# Altium project TEMD_ESA.PrjPcb
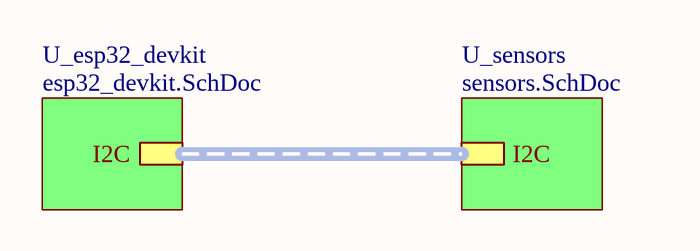
[diagram p0: main.SchDoc]
3 sheets, 13 parts. Net scope: hierarchical (ports join the sheet entries above them; power ports are global).
Board file: TEMD_ESA_PCB.PcbDoc
Sheets:
  main.SchDoc
    U_esp32_devkit = esp32_devkit.SchDoc
    U_sensors = sensors.SchDoc

## Sheet main.SchDoc
size A4; SheetNumber: 1; SheetTotal: 4

### Sub-sheets
U_esp32_devkit = esp32_devkit.SchDoc: I2C (harness I2C)
U_sensors = sensors.SchDoc: I2C (harness I2C)

### Buses and harness runs
harness sheet U_esp32_devkit/I2C = sheet U_sensors/I2C

## Sheet esp32_devkit.SchDoc
size A4; SheetNumber: 3; SheetTotal: 3
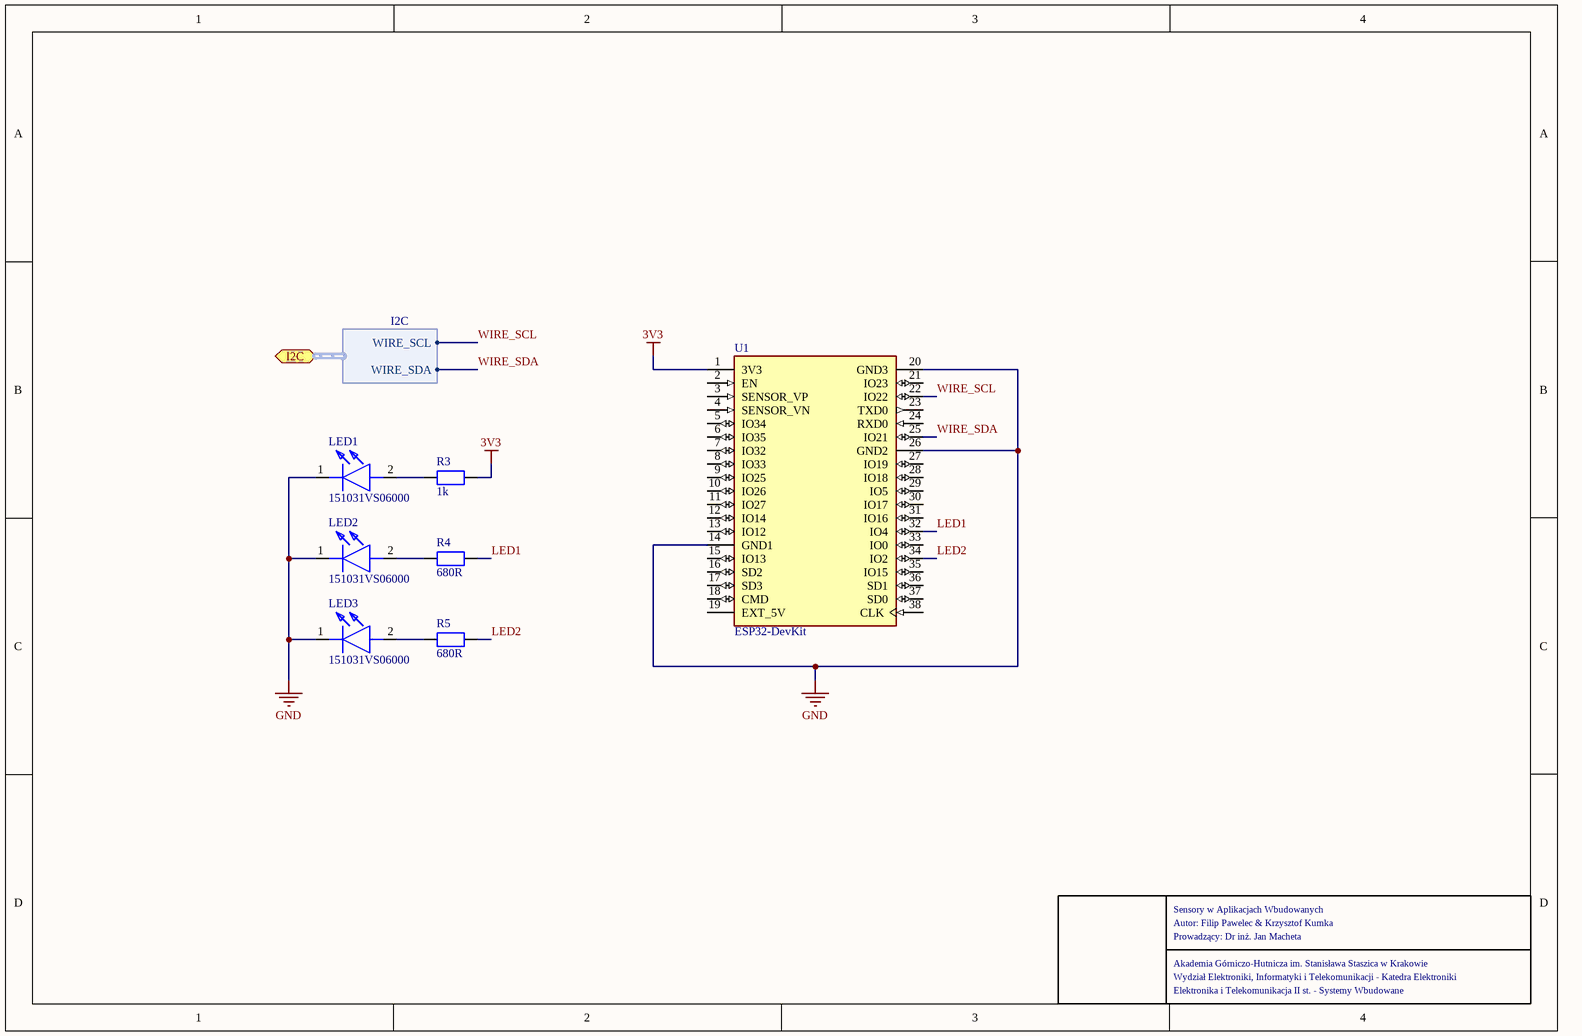
[diagram p1: esp32_devkit.SchDoc]

### Parts
LED1  151031VS06000  [151034GS03000]
LED2  151031VS06000  [151034GS03000]
LED3  151031VS06000  [151034GS03000]
R3  1k  [R0603]
R4  680R  [R0603]
R5  680R  [R0603]
U1  ESP32-DevKit  [MODULE_ESP32-DEVKIT]

### Ports
I2C (bidir, harness I2C)

### Harnesses
I2C: WIRE_SCL, WIRE_SDA

### Nets
3V3: R3.2 U1.1(3V3)
GND: LED1.1(K) LED2.1(K) LED3.1(K) U1.14(GND1) U1.20(GND3) U1.26(GND2)
LED1: R4.2 U1.32(IO4)
LED2: R5.2 U1.34(IO2)
WIRE_SCL: U1.22(IO22) ; port I2C.WIRE_SCL
WIRE_SDA: U1.25(IO21) ; port I2C.WIRE_SDA
NetLED1_2: LED1.2(A) R3.1
NetLED2_2: LED2.2(A) R4.1
NetLED3_2: LED3.2(A) R5.1

Not connected (* = marked no-connect by the designer): U1 2(EN) 3(SENSOR_VP) 4(SENSOR_VN) 5(IO34) 6(IO35) 7(IO32) 8(IO33) 9(IO25) 10(IO26) 11(IO27) 12(IO14) 13(IO12) 15(IO13) 16(SD2) 17(SD3) 18(CMD) 19(EXT_5V) 21(IO23) 23(TXD0) 24(RXD0) 27(IO19) 28(IO18) 29(IO5) 30(IO17) 31(IO16) 33(IO0) 35(IO15) 36(SD1) 37(SD0) 38(CLK)

### Notes on the sheet
- Autor: Filip Pawelec & Krzysztof Kumka
- Sensory w Aplikacjach Wbudowanych
- Akademia Górniczo-Hutnicza im. Stanisława Staszica w Krakowie
- Prowadzący: Dr inż. Jan Macheta
- Wydział Elektroniki, Informatyki i Telekomunikacji - Katedra Elektroniki
- Elektronika i Telekomunikacja II st. - Systemy Wbudowane

### Library data of the parts
LED1-LED3 = 151031VS06000: LED; Manufacturer_Name: Wurth Elektronik; Datasheet Link: https://componentsearchengine.com//151031VS06000.pdf; Mouser2 Part Number: 710-151031VS06000; Mouser2 Price/Stock: https://www.mouser.com/Search/Refine.aspx?Keyword=710-151031VS06000; Manufacturer_Part_Number: 151031VS06000
R3-R5 = R0603: Resistor
  R3: value: 1k
  R4 R5: value: 680R
U1 = ESP32_DEVKIT: ESP32-DevKitC-32UE

## Sheet sensors.SchDoc
size A4; SheetNumber: 2; SheetTotal: 3
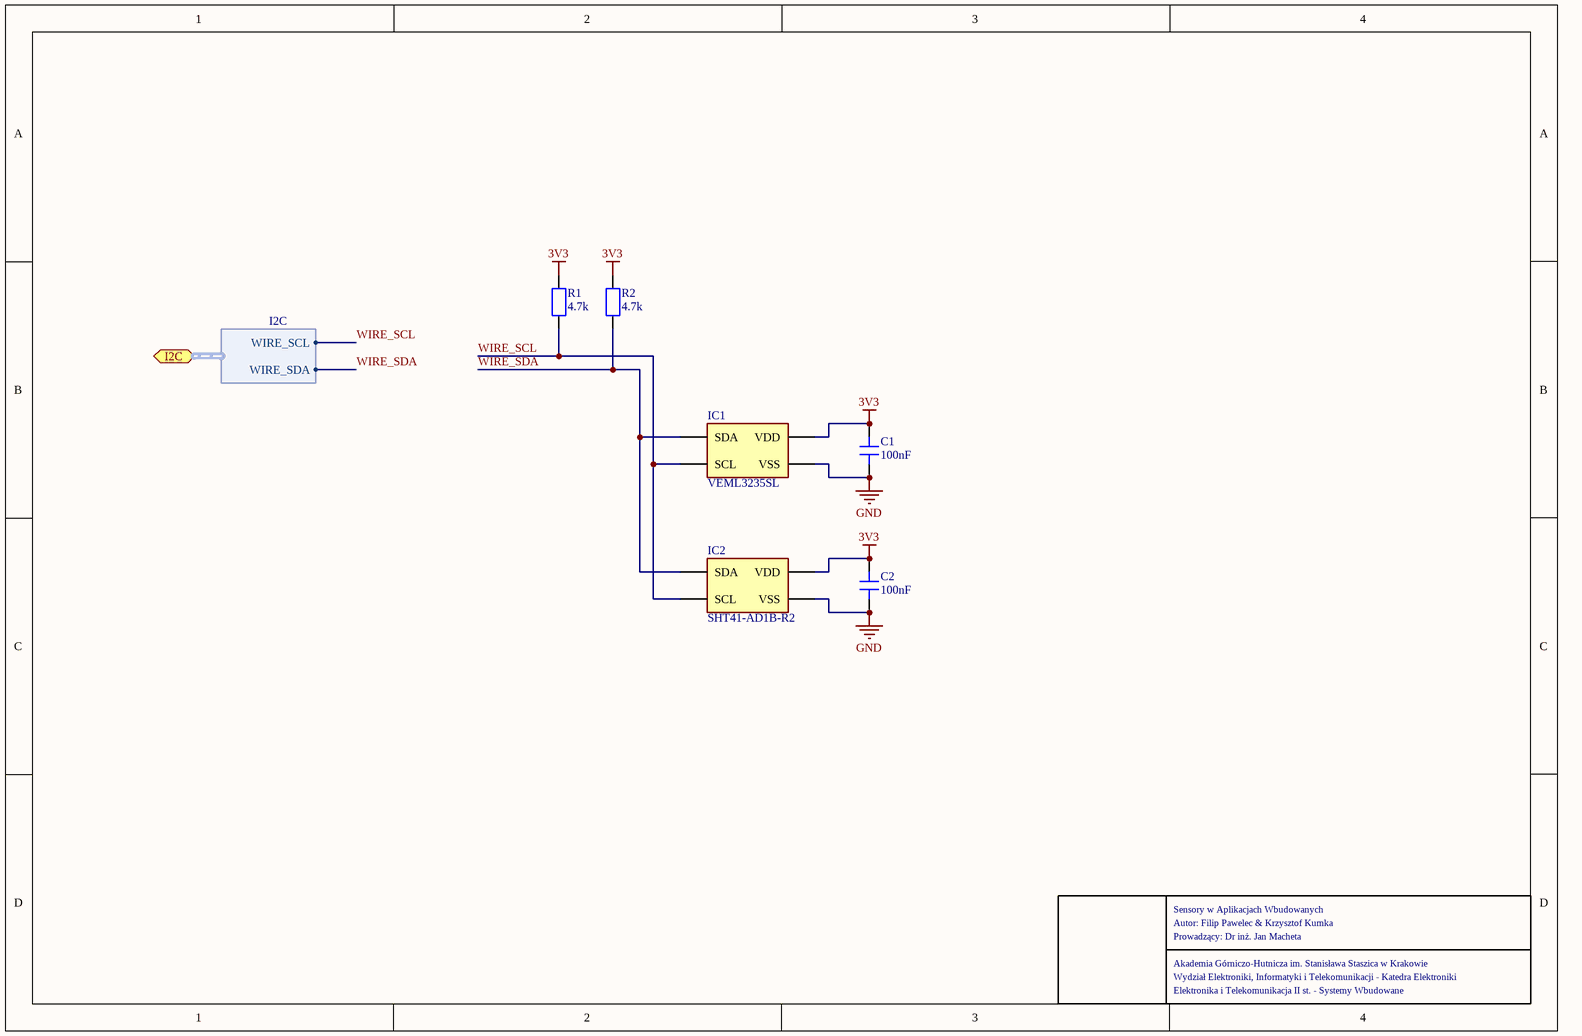
[diagram p2: sensors.SchDoc]

### Parts
C1  100nF  [C0603]
C2  100nF  [C0603]
IC1  VEML3235SL  [VEML3235SL]
IC2  SHT41-AD1B-R2  [SHT41AD1BR2]
R1  4.7k  [R0603]
R2  4.7k  [R0603]

### Ports
I2C (bidir, harness I2C)

### Harnesses
I2C: WIRE_SCL, WIRE_SDA

### Nets
3V3: C1.2 C2.2 IC1.1(VDD) IC2.3(VDD) R1.2 R2.2
GND: C1.1 C2.1 IC1.2(VSS) IC2.4(VSS)
WIRE_SCL: IC1.4(SCL) IC2.2(SCL) R1.1 ; port I2C.WIRE_SCL
WIRE_SDA: IC1.3(SDA) IC2.1(SDA) R2.1 ; port I2C.WIRE_SDA

### Notes on the sheet
- Autor: Filip Pawelec & Krzysztof Kumka
- Sensory w Aplikacjach Wbudowanych
- Akademia Górniczo-Hutnicza im. Stanisława Staszica w Krakowie
- Prowadzący: Dr inż. Jan Macheta
- Wydział Elektroniki, Informatyki i Telekomunikacji - Katedra Elektroniki
- Elektronika i Telekomunikacja II st. - Systemy Wbudowane

### Library data of the parts
C1 C2 = C0603: Capacitor; value: 100nF
IC1 = VEML3235SL: Integrated Circuit
IC2 = SHT41-AD1B-R2: Integrated Circuit; Manufacturer_Name: Sensirion; Datasheet Link: https://sensirion.com/media/documents/33FD6951/61641E1E/Sensirion_Humidity_Sensors_SHT4x_Datasheet.pdf; Height: 0.59mm; Manufacturer_Part_Number: SHT41-AD1B-R2
R1 R2 = R0603: Resistor; value: 4.7k

## Nets that join several sheets
3V3: esp32_devkit (R3.2 U1.1), sensors (6 pins)
GND: esp32_devkit (6 pins), sensors (C1.1 C2.1 IC1.2 IC2.4)
WIRE_SCL: esp32_devkit (U1.22), sensors (IC1.4 IC2.2 R1.1)
WIRE_SDA: esp32_devkit (U1.25), sensors (IC1.3 IC2.1 R2.1)